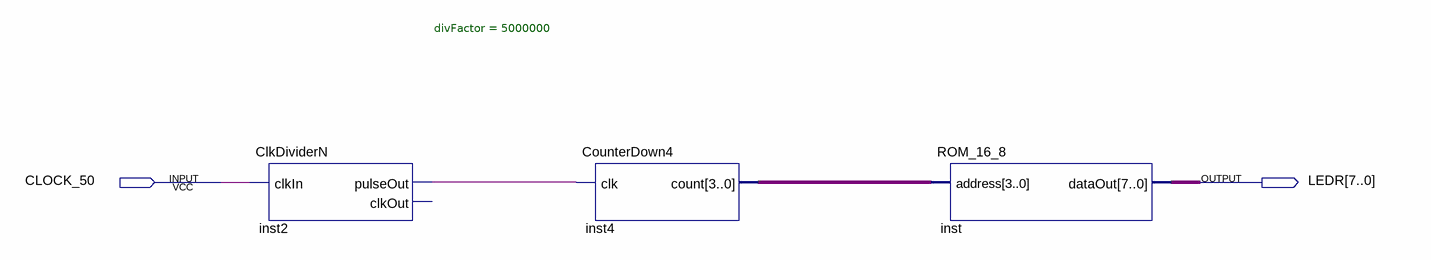
[diagram p0: schematic sheet]
// Quartus schematic ROM_Demo.bdf as structural Verilog: 3 symbols, 2 pins
module ROM_Demo (
  input  CLOCK_50,
  output [7:0] LEDR
);

  wire inst2_pulseout;
  wire [3:0] inst4_count;

  ClkDividerN #(.divFactor(5000000)) inst2 (.clkIn(CLOCK_50), .pulseOut(inst2_pulseout));  // open: clkOut
  CounterDown4 inst4 (.clk(inst2_pulseout), .count(inst4_count));
  ROM_16_8 inst (.address(inst4_count), .dataOut(LEDR));
endmodule
